# EAGLE design Radio_bridge (EAGLE 9.6.2)

## Sheet 1 of 2
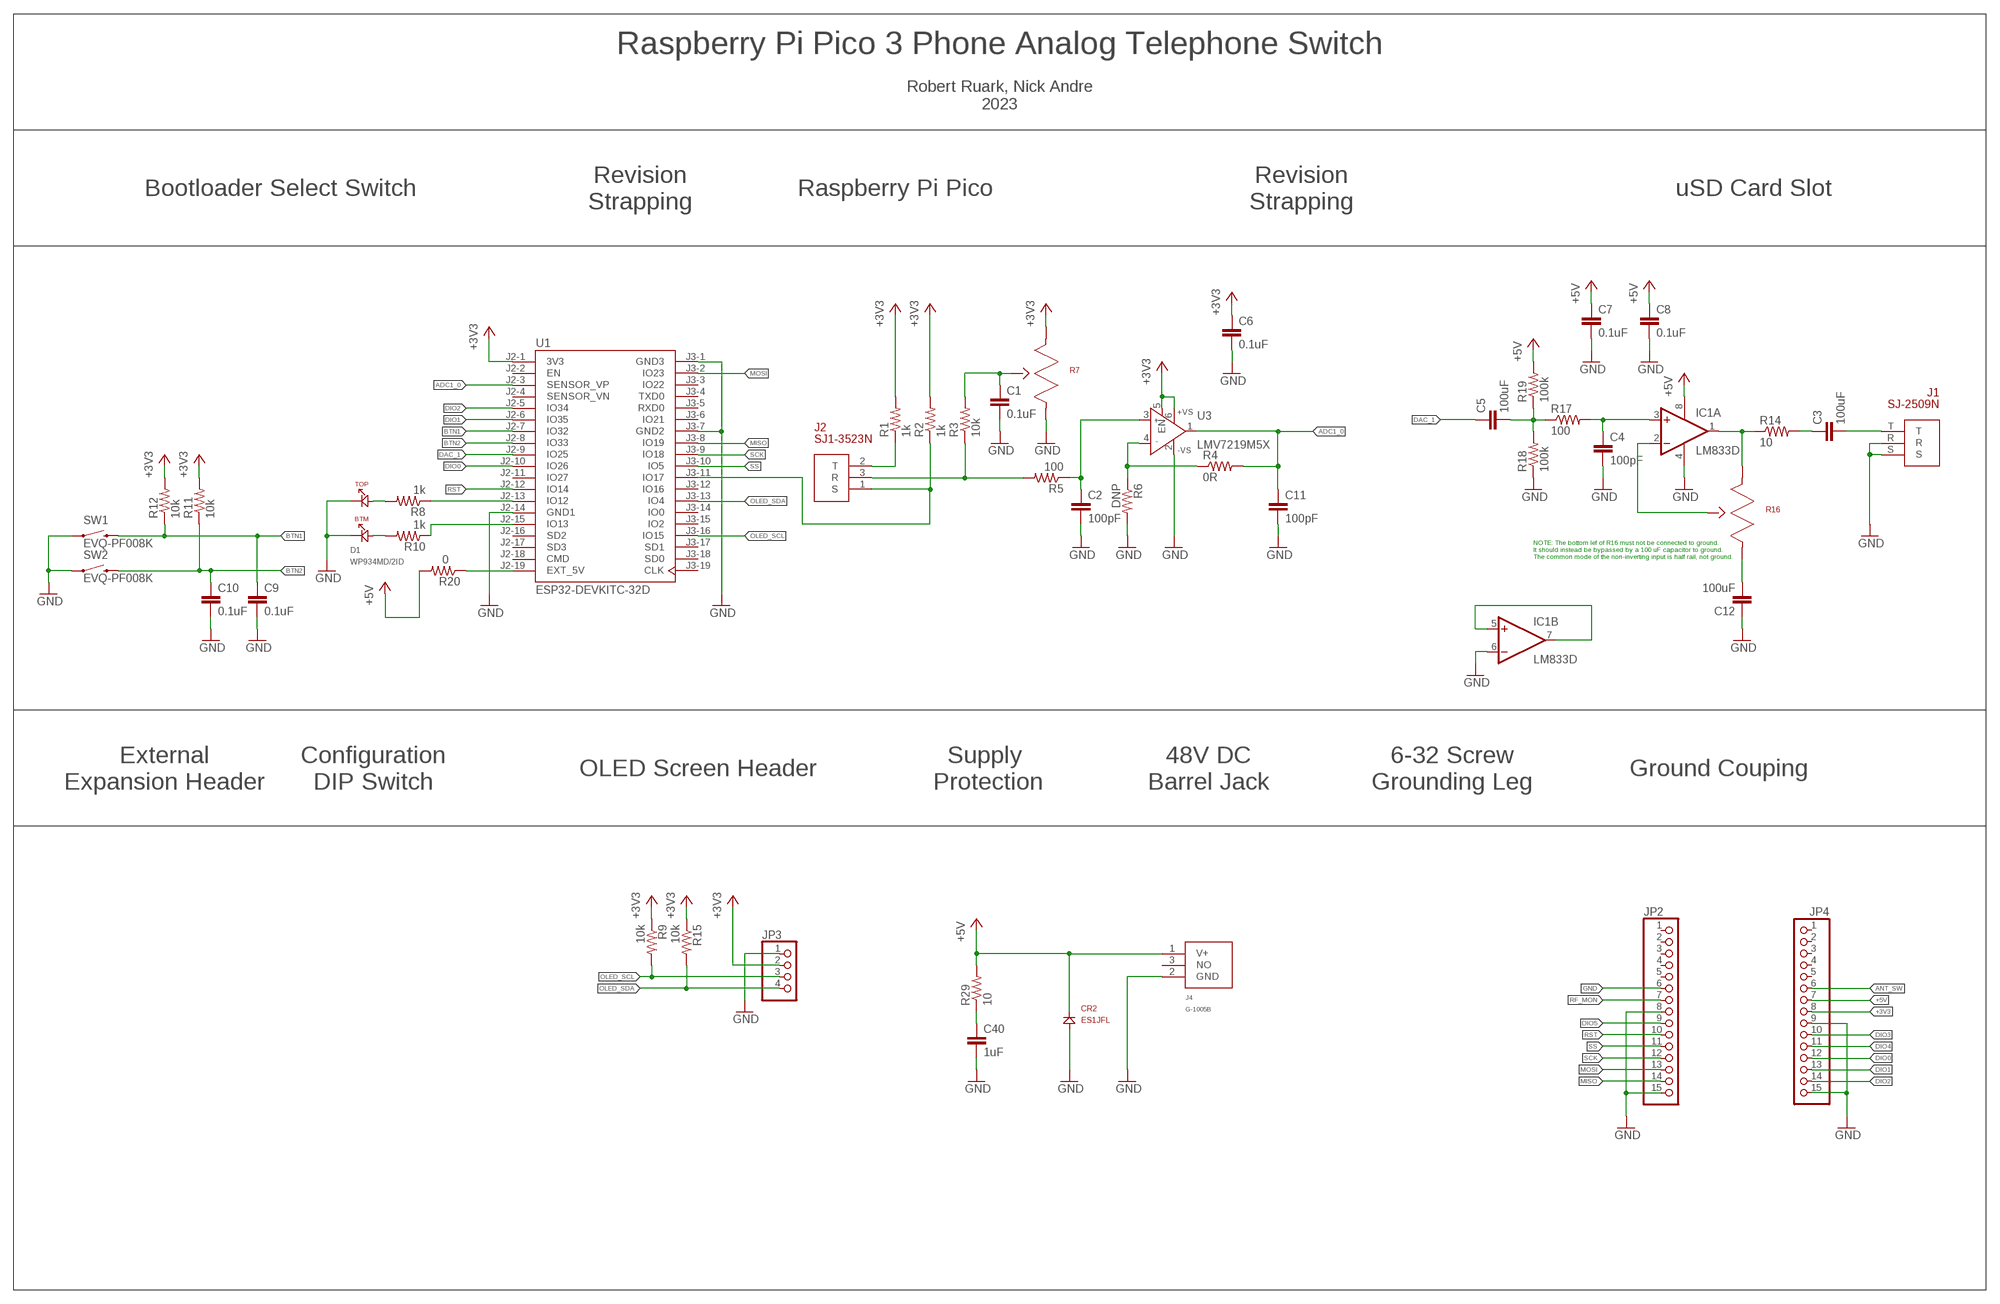
[diagram p0: schematic, sheet 1]

### Parts
C1  0.1uF  0603_CAPACITOR  [0603]
C2  100pF  0603_CAPACITOR  [0603]
C3  100uF  1210_CAPACITOR  [1210]
C4  100pF  0603_CAPACITOR  [0603]
C5  100uF  1210_CAPACITOR  [1210]
C6  0.1uF  0603_CAPACITOR  [0603]
C7  0.1uF  0603_CAPACITOR  [0603]
C8  0.1uF  0603_CAPACITOR  [0603]
C9  0.1uF  0603_CAPACITOR  [0603]
C10  0.1uF  0603_CAPACITOR  [0603]
C11  100pF  0603_CAPACITOR  [0603]
C12  100uF  1210_CAPACITOR  [1210]
C40  1uF  1206_CAPACITOR  [1206]
CR2  ES1JFL  [SOD123(AK)]
D1  WP934MD/2ID  [WP934MD/2ID]
IC1  LM833D  [SO08]
J1  SJ-2509N  [2.5MM_TRS]
J2  SJ1-3523N  [SJ1-3523N]
J4  G-1005B  [G-1005B]
JP2  PINHD-1X15  [1X15]
JP3  PINHD-1X4  [1X04]
JP4  PINHD-1X15  [1X15]
R1  1k  0603_RESISTOR  [0603]
R2  1k  0603_RESISTOR  [0603]
R3  10k  0603_RESISTOR  [0603]
R4  0R  0603_RESISTOR  [0603]
R5  100  0603_RESISTOR  [0603]
R6  DNP  0603_RESISTOR  [0603]
R7  10k  PTV09A-4025F-A103  [PTV09]
R8  1k  0603_RESISTOR  [0603]
R9  10k  0603_RESISTOR  [0603]
R10  1k  0603_RESISTOR  [0603]
R11  10k  0603_RESISTOR  [0603]
R12  10k  0603_RESISTOR  [0603]
R14  10  0603_RESISTOR  [0603]
R15  10k  0603_RESISTOR  [0603]
R16  10k  PTV09A-4025F-A103  [PTV09]
R17  100  0603_RESISTOR  [0603]
R18  100k  0603_RESISTOR  [0603]
R19  100k  0603_RESISTOR  [0603]
R20  0  0603_RESISTOR  [0603]
R29  10  1206_RESISTOR  [1206]
SW1  EVQ-PF008K  [EVQ-PF008K]
SW2  EVQ-PF008K  [EVQ-PF008K]
U1  ESP32-DEVKITC-32D  [MODULE_ESP32-DEVKITC-32D]
U3  LMV7219M5X  [SOT23-6]

### Nets
+3V3: C6.1 JP3.2 JP4.8 R1.2 R2.2 R7.1 R9.1 R11.2 R12.2 R15.1 U1.J2-1(3V3) U3.5(EN) U3.6(+VS)
+5V: C7.1 C8.1 CR2.K IC1.8(P:V+) J4.1(V+) JP4.7 R19.2 R20.2 R29.2
ADC1_0: C11.1 R4.2 U1.J2-3(SENSOR_VP) U3.1(OUT)
ANT_SW: JP4.6
BTN1: C9.1 R12.1 SW1.S2 U1.J2-7(IO32)
BTN2: C10.1 R11.1 SW2.S2 U1.J2-8(IO33)
DAC_1: C5.1 U1.J2-9(IO25)
DIO0: JP4.12 U1.J2-10(IO26)
DIO1: JP4.13 U1.J2-6(IO35)
DIO2: JP4.14 U1.J2-5(IO34)
DIO3: JP4.10
DIO4: JP4.11
DIO5: JP2.9
GND: C1.2 C2.2 C4.2 C6.2 C7.2 C8.2 C9.2 C10.2 C11.2 C12.1 C40.2 CR2.A D1.K1 D1.K2 IC1.4(P:V-) IC1.6(B:-IN) J1.R J1.S J4.2(GND) JP2.6 JP2.8 JP2.15 JP3.1 JP4.9 JP4.15 R6.2 R7.3 R18.1 SW1.S1 SW2.S1 U1.J2-14(GND1) U1.J3-1(GND3) U1.J3-7(GND2) U3.2(-VS)
MIC: C2.1 R5.1 U3.3(IN+)
MISO: JP2.14 U1.J3-8(IO19)
MOSI: JP2.13 U1.J3-2(IO23)
N$1: J2.2(T) R1.1
N$2: C1.1 R3.2 R7.2
N$3: R4.1 R6.1 U3.4(IN-)
N$4: J2.1(S) R2.1 U1.J3-11(IO17)
N$5: C3.2 J1.T
N$6: J2.3(R) R3.1 R5.2
N$7: D1.A2 R8.2
N$8: D1.A1 R10.2
N$9: R8.1 U1.J2-13(IO12)
N$10: R10.1 U1.J2-15(IO13)
N$11: C12.2 R16.3
N$12: IC1.5(B:+IN) IC1.7(B:OUT)
N$13: IC1.1(A:OUT) R14.1 R16.1
N$14: C3.1 R14.2
N$16: IC1.2(A:-IN) R16.2
N$17: C4.1 IC1.3(A:+IN) R17.2
N$18: C5.2 R17.1 R18.2 R19.1
N$20: R20.1 U1.J2-19(EXT_5V)
N$27: C40.1 R29.1
OLED_SCL: JP3.3 R9.2 U1.J3-16(IO15)
OLED_SDA: JP3.4 R15.2 U1.J3-13(IO4)
RF_MON: JP2.7
RST: JP2.10 U1.J2-12(IO14)
SCK: JP2.12 U1.J3-9(IO18)
SS: JP2.11 U1.J3-10(IO5)
Unconnected: J4.3(NO) JP2.1 JP2.2 JP2.3 JP2.4 JP2.5 JP4.1 JP4.2 JP4.3 JP4.4 JP4.5 U1.J2-2(EN) U1.J2-4(SENSOR_VN) U1.J2-11(IO27) U1.J2-16(SD2) U1.J2-17(SD3) U1.J2-18(CMD) U1.J3-3(IO22) U1.J3-4(TXD0) U1.J3-5(RXD0) U1.J3-6(IO21) U1.J3-12(IO16) U1.J3-14(IO0) U1.J3-15(IO2) U1.J3-17(SD1) U1.J3-18(SD0) U1.J3-19(CLK)

### Notes on the sheet
- Raspberry Pi Pico 3 Phone Analog Telephone Switch
- Robert Ruark, Nick Andre
  2023
- Bootloader Select Switch
- Revision
  Strapping
- Raspberry Pi Pico
- Revision
  Strapping
- uSD Card Slot
- NOTE: The bottom lef of R16 must not be connected to ground.
  It should instead be bypassed by a 100 uF capacitor to ground.
  The common mode of the non-inverting input is half rail, not ground.
- External
  Expansion Header
- Configuration
  DIP Switch
- OLED Screen Header
- Supply 
  Protection
- 48V DC
  Barrel Jack
- 6-32 Screw
  Grounding Leg
- Ground Couping

## Sheet 2 of 2
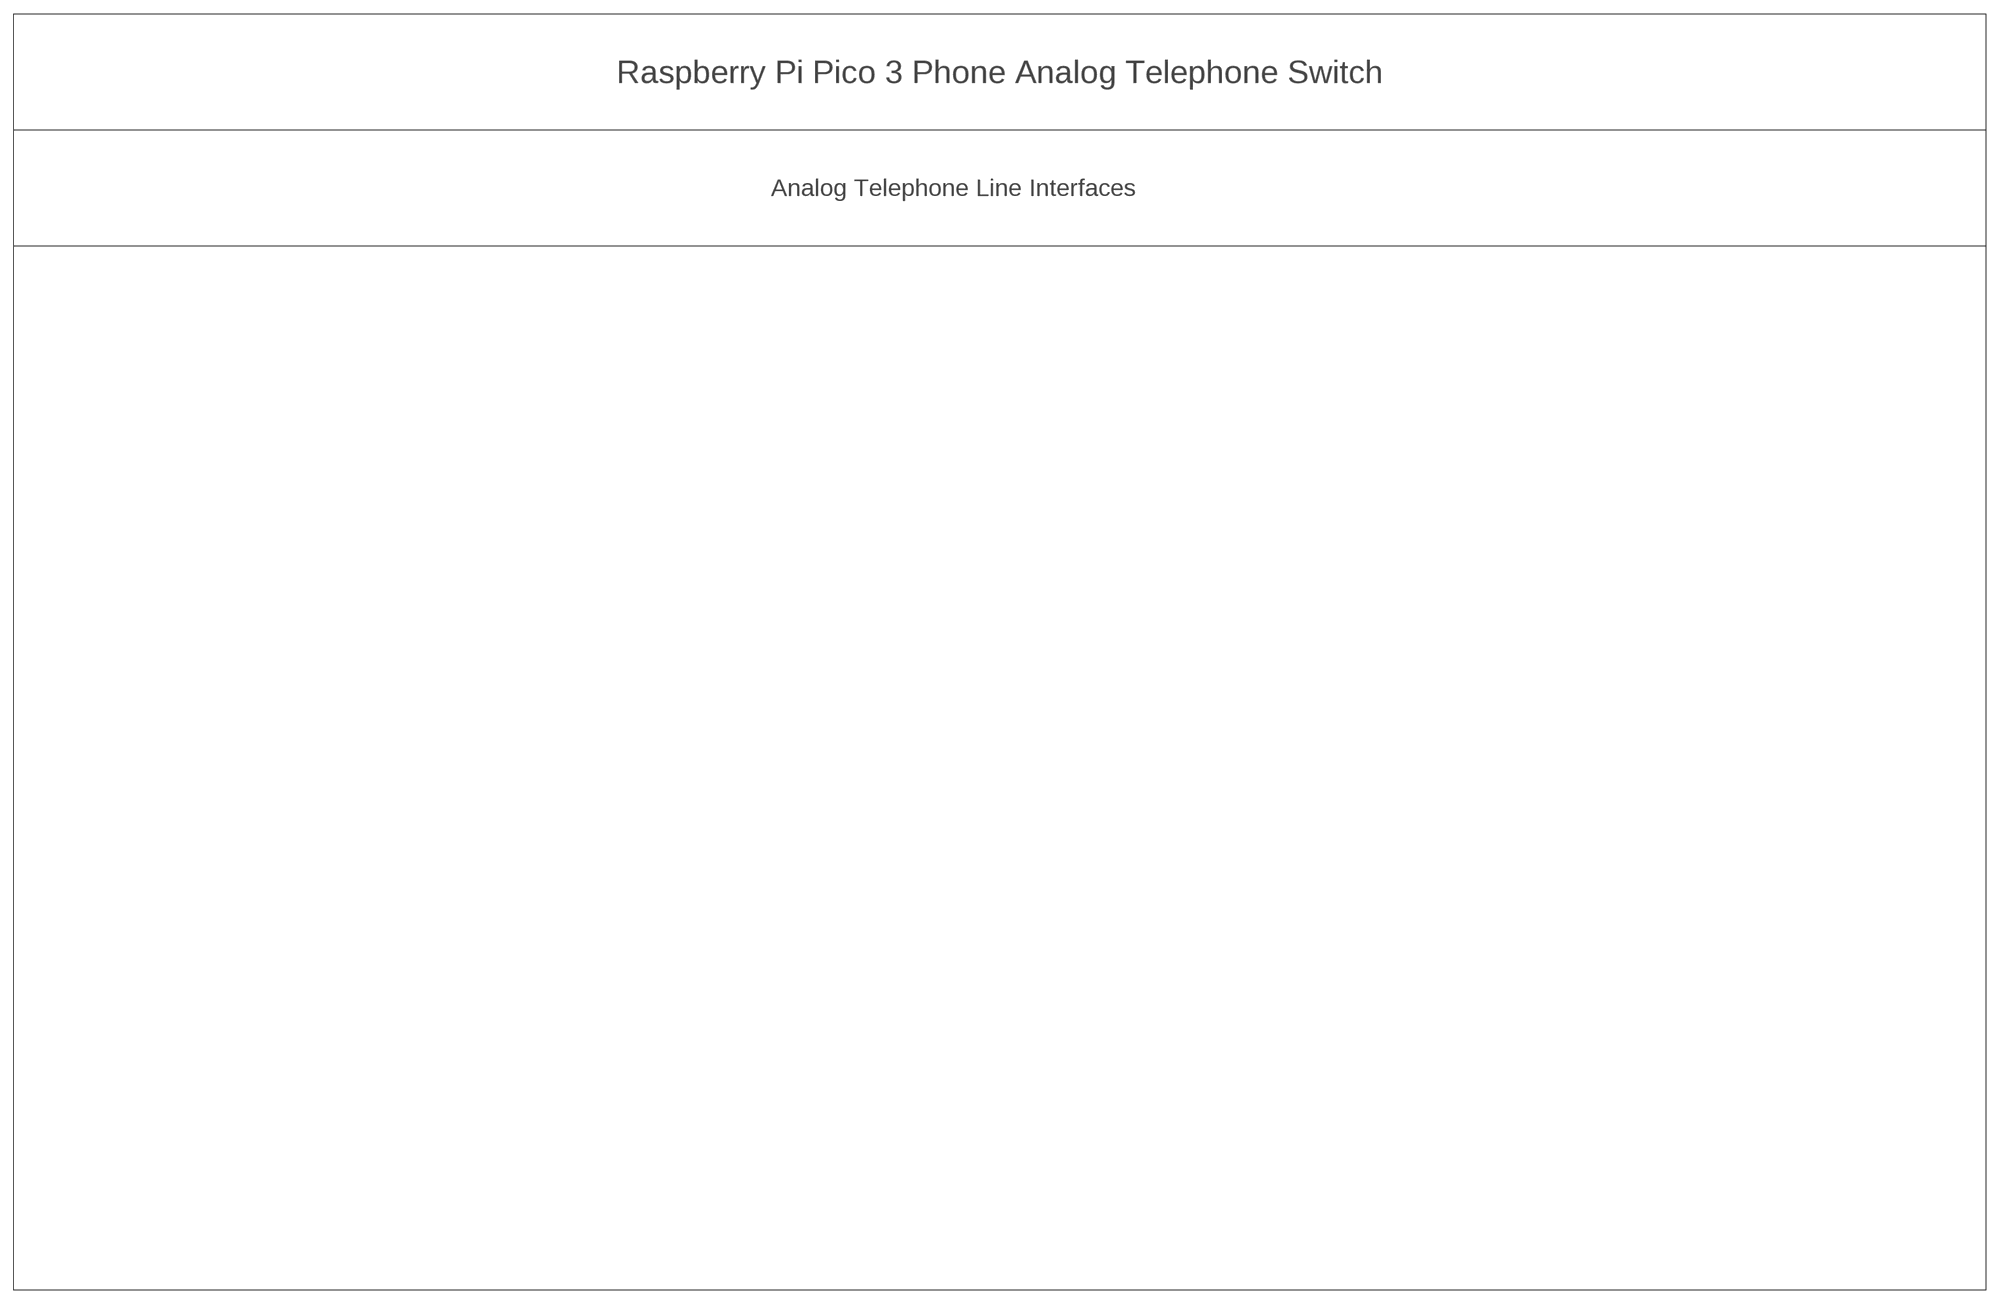
[diagram p1: schematic, sheet 2]

### Notes on the sheet
- Raspberry Pi Pico 3 Phone Analog Telephone Switch
- Analog Telephone Line Interfaces

## Library data of the parts
C1 C2 C4 C6-C11 = ruark2:0603_CAPACITOR: 0603 Capacitor -- WARNING: NO DEFINED VALUE OR PART NUMBER; VALUE: sel
C3 C5 C12 = ruark2:1210_CAPACITOR: NO VALUE
C40 = ruark2:1206_CAPACITOR: NO DEFINED PN; VALUE: sel
CR2 = ruark2:ES1JFL: Diode Standard 600 V 1A Surface Mount SOD-123F; PARTNO: ES1JFLCT-ND
D1 = ruark2:WP934MD/2ID: LED Circuit Board Indicator LED Circuit Board Indicator 2 High Red (x 2) Diffused, Tinted 2V 30mA Round with Domed Top 3mm, T-1 Through Hole, Right Angle. Compatible with SSF-LXH240IID
IC1 = linear:LM833: OP AMP
J1 = ruark2:SJ-2509N: 2.50mm (0.094", 3/32", Sub Mini, Miniature) - Headphone Phone Jack Stereo Connector Solder; PARTNO: CP-S2509N-ND
J2 = ruark2:SJ1-3523N: 3.50mm (0.141", 1/8", Mini Plug) - Headphone Phone Jack Stereo (3 Conductor, TRS) Connector Solder; PARTNO: CP1-3523N-ND
J4 = ruark2:G-1005B: Power Barrel Connector Jack 2.50mm ID (0.098"), 5.50mm OD (0.217") Through Hole, Right Angle; PARTNO: 1939-G-1005B-ND
JP2 JP4 = pinhead:PINHD-1X15: PIN HEADER
JP3 = pinhead:PINHD-1X4: PIN HEADER
R1-R6 R8-R12 R14 R15 R17-R20 = ruark2:0603_RESISTOR: 0603 Resistor -- WARNING: NO DEFINED PART NUMBER OR VALUE; VALUE: sel
R7 R16 = ruark2:PTV09A-4025F-A103: 10k Ohm 1 Gang Logarithmic Through Hole, Snap In Potentiometer None 1 Turn Carbon 0.05W, 1/20W PC Pins, Board Locks; PARTNO: PTV09A-4025F-A103-ND
R29 = ruark2:1206_RESISTOR: NO DEFINED PN; VALUE: sel
SW1 SW2 = ruark2:EVQ-PF008K: Tactile Switch SPST-NO Side Actuated Through Hole, Right Angle; PARTNO: P10880S-ND
U1 = ESP32-DEVKITC-32D:ESP32-DEVKITC-32D: Check availability <https://pricing.snapeda.com/parts/ESP32-DEVKITC-32D/Espressif%20Systems/view-part?ref=eda>; AVAILABILITY: In Stock; DESCRIPTION: WiFi Development Tools (802.11) ESP32 General Development Kit, ESP32-WROOM-32D on the board; MF: Espressif Systems; MP: ESP32-DEVKITC-32D; PACKAGE: None; PRICE: None; PURCHASE-URL: https://pricing.snapeda.com/search/part/ESP32-DEVKITC-32D/?ref=eda
U3 = ruark2:LMV7219M5X: Comparator General Purpose Push-Pull, Rail-to-Rail SOT-23-5 (OPA320 pinout compatible); PARTNO: LMV7219M5X-ND

## Net classes
1 HV: clearance 0.406 mm

## Board
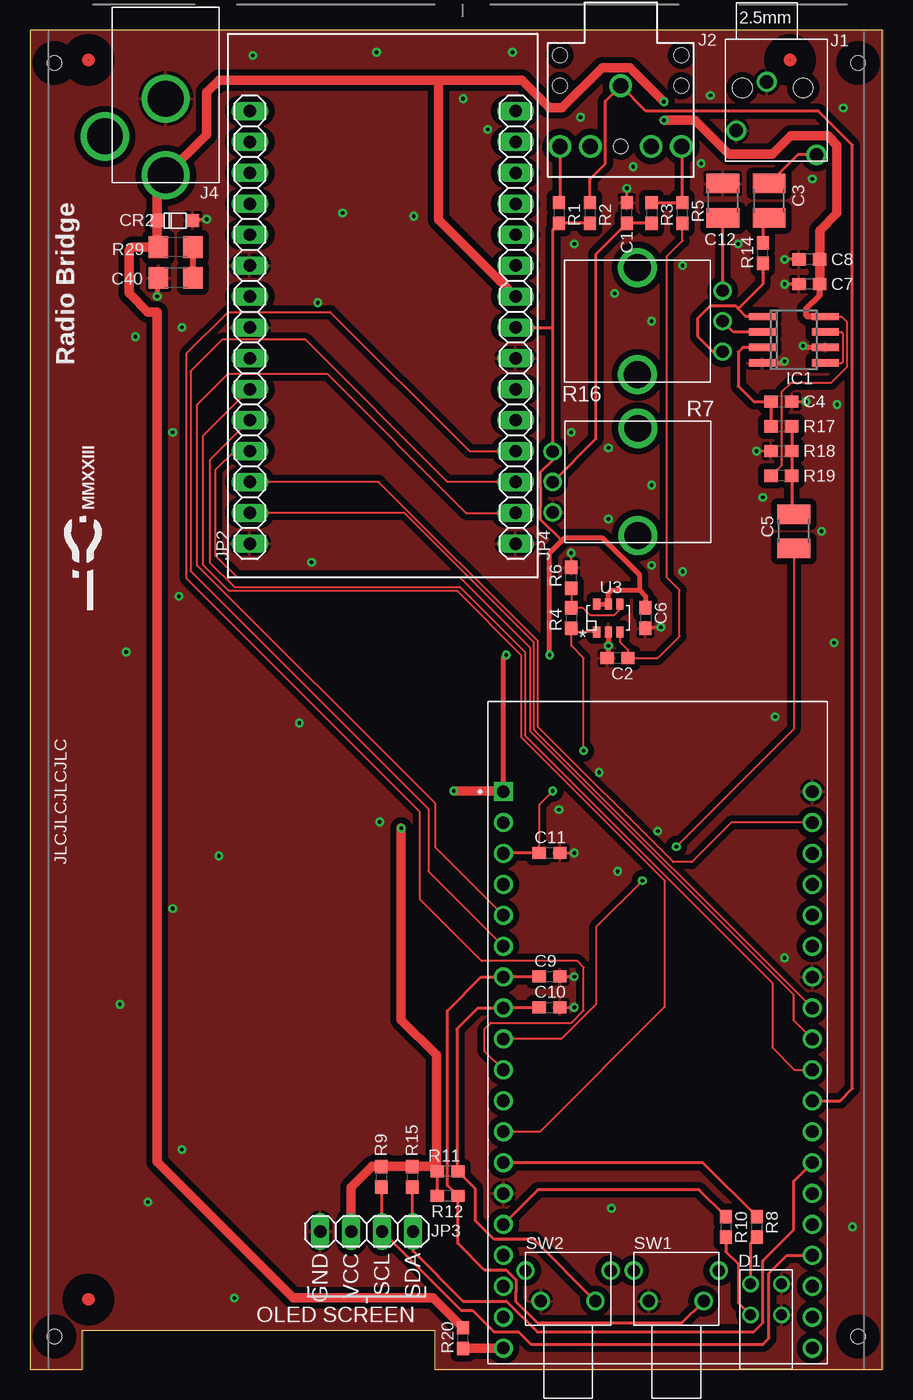
[diagram p2: board, top side]
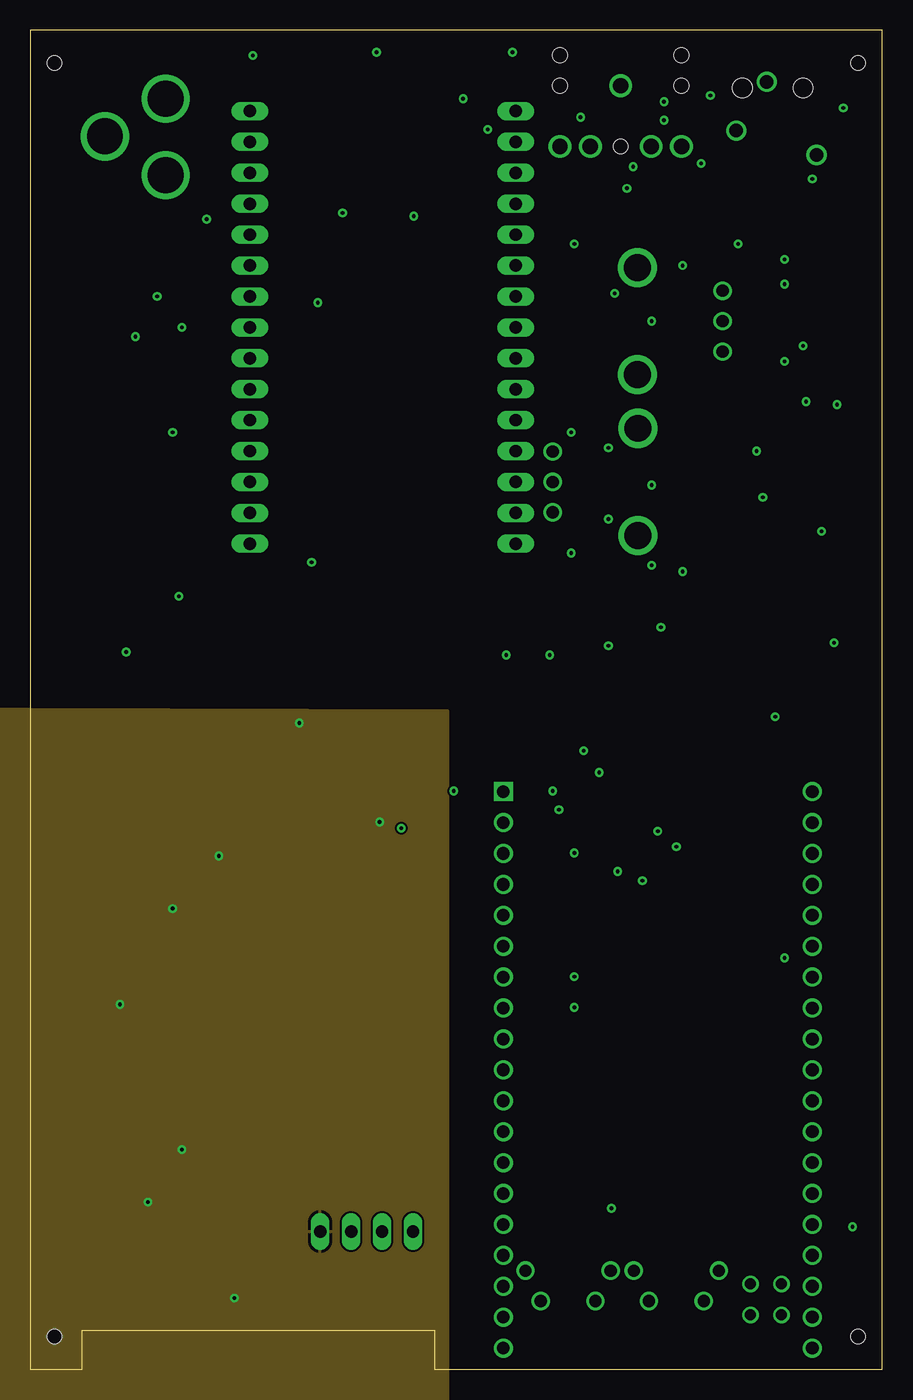
[diagram p3: board, inner layer Route2]
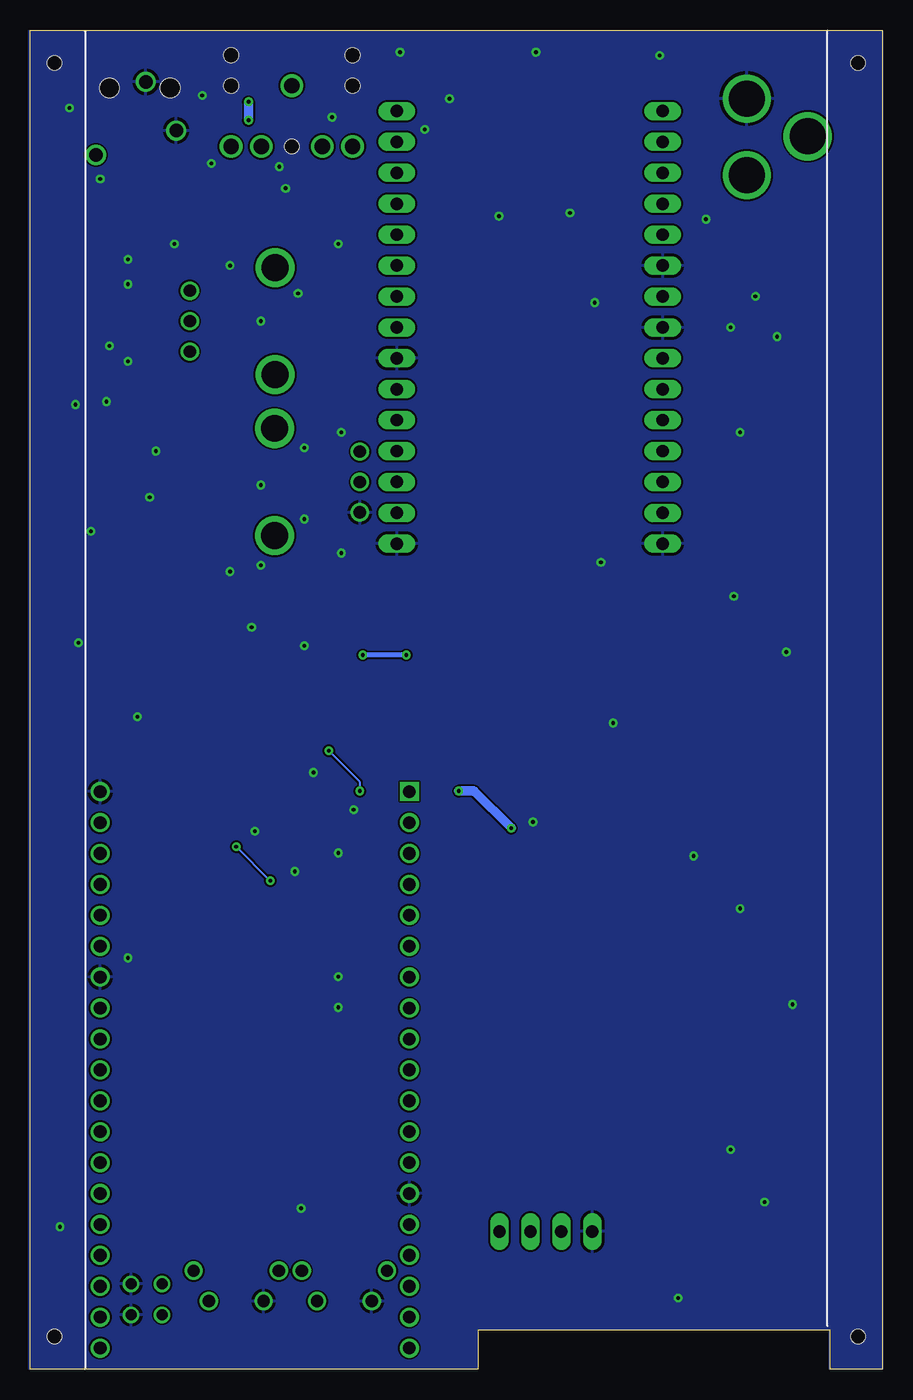
[diagram p4: board, bottom side, seen from below]

Size 70 x 110 mm. Coordinates in mm from the lower left corner, seen from the top.
Outline: 0,0 4.27,0 4.27,3.18 33.22,3.18 33.22,0 70,0 70,110 0,110 0,0
Copper layers (1*16): Top 0.035mm / dielectric 1.5mm / Bottom 0.035mm
Design rules "default *": minimum track width 6mil, minimum drill 12mil, track to track 6mil, track to pad 6mil, pad to pad 6mil, via to via 6mil, smd to smd 6mil, copper to edge 0mil, drill to drill 6mil, minimum pad ring 0.13mm, minimum via ring 8mil, stop-mask expansion 4mil, vias tented up to drill 12mil, thermal gap 10mil
Holes 1.15 mm at 1.98,107.32 68.02,107.32 1.98,2.68 68.02,2.68
tRestrict: area 3.7,106.5 to 5.9,108.7; area 61.3,106.5 to 63.5,108.7; area 3.7,4.6 to 5.9,6.8; area 1,106.3 to 3,108.3; area 67,106.3 to 69,108.3; area 67,1.7 to 69,3.7; area 1,1.7 to 3,3.7
bRestrict: area 32,-53.3 to 34,-51.3; area -34,-53.3 to -32,-51.3

### Footprints (pad centres in the part's own frame; a part is rotated, then mirrored left to right if it is on the bottom)
0603 = smd 1.1 x 1: 1 -0.85,0; 2 0.85,0
1210 = smd 1.6 x 2.7: 1 -1.4,0; 2 1.4,0
1206 = smd 1.6 x 1.8: 1 -1.4,0; 2 1.4,0
SOD123(AK) = smd 1.1 x 1.1: A 1.45,0; K -1.45,0
WP934MD/2ID = drill 0.9: A1 -1.27,4.45; A2 -1.27,6.99; K1 1.27,4.45; K2 1.27,6.99
SO08 = smd 0.6 x 2.2: 1 -1.905,-2.6; 2 -0.635,-2.6; 3 0.635,-2.6; 4 1.905,-2.6; 5 1.905,2.6; 6 0.635,2.6; 7 -0.635,2.6; 8 -1.905,2.6
2.5MM_TRS = drill 1.1: R 2.5,7.5; S 0,3.5; T -4.1,9.5 | hole 1.6: -3,4; 2,4
SJ1-3523N = drill 1.25: 1 0,-3.5; 2 -5,-8.5; 3 5,-8.5; 10 -2.5,-8.5; 11 2.5,-8.5 | hole 1.2: 0,-8.5; 5,-1; -5,-1; 5,-3.5; -5,-3.5
G-1005B = drill 2.95: 1 0,13.8; 2 0,7.5; 3 5,10.6
1X15 = drill 1.016 long: 1 -17.78,0; 2 -15.24,0; 3 -12.7,0; 4 -10.16,0; 5 -7.62,0; 6 -5.08,0; 7 -2.54,0; 8 0,0; 9 2.54,0; 10 5.08,0; 11 7.62,0; 12 10.16,0; 13 12.7,0; 14 15.24,0; 15 17.78,0
1X04 = drill 1.016 long: 1 -3.81,0; 2 -1.27,0; 3 1.27,0; 4 3.81,0
PTV09 = drill 1: 1 -2.5,0; 2 0,0; 3 2.5,0 | drill 2.2: NC1 -4.4,7; NC2 4.4,7
EVQ-PF008K = drill 1: NC1 -3.5,2.5; NC2 3.5,2.5; S1 -2.25,0; S2 2.25,0
MODULE_ESP32-DEVKITC-32D = drill 1.04 square: J2-1 -12.7,19.76 | drill 1.04: J2-2 -12.7,17.22; J2-3 -12.7,14.68; J2-4 -12.7,12.14; J2-5 -12.7,9.6; J2-6 -12.7,7.06; J2-7 -12.7,4.52; J2-8 -12.7,1.98; J2-9 -12.7,-0.56; J2-10 -12.7,-3.1; J2-11 -12.7,-5.64; J2-12 -12.7,-8.18; J2-13 -12.7,-10.72; J2-14 -12.7,-13.26; J2-15 -12.7,-15.8; J2-16 -12.7,-18.34; J2-17 -12.7,-20.88; J2-18 -12.7,-23.42; J2-19 -12.7,-25.96; J3-1 12.7,19.76; J3-2 12.7,17.22; J3-3 12.7,14.68; J3-4 12.7,12.14; J3-5 12.7,9.6; J3-6 12.7,7.06; J3-7 12.7,4.52; J3-8 12.7,1.98; J3-9 12.7,-0.56; J3-10 12.7,-3.1; J3-11 12.7,-5.64; J3-12 12.7,-8.18; J3-13 12.7,-10.72; J3-14 12.7,-13.26; J3-15 12.7,-15.8; J3-16 12.7,-18.34; J3-17 12.7,-20.88; J3-18 12.7,-23.42; J3-19 12.7,-25.96
SOT23-6 = smd 0.6 x 0.9: 1 -0.95,-1.15; 2 0,-1.15; 3 0.95,-1.15; 4 0.95,1.15; 5 0,1.15; 6 -0.95,1.15

### Placement (x,y rotation side)
C1  49.02,95 90 top
C2  48.26,58.42 180 top
C3  60.71,96.01 90 top
C4  61.72,79.5 0 top
C5  62.74,68.83 90 top
C6  50.55,61.72 270 top
C7  64.01,89.15 180 top
C8  64.01,91.19 180 top
C9  42.67,32.26 0 top
C10  42.67,29.72 0 top
C11  42.67,42.42 0 top
C12  56.9,96.01 270 top
C40  11.94,89.66 180 top
CR2  11.89,94.37 0 top
D1  60.45,0 0 top
IC1  62.74,84.58 270 top
J1  60.51,109.27 180 top
J2  48.51,108.97 0 top
J4  11.12,111.9 180 top
JP2  18.03,85.6 270 top
JP3  27.63,11.31 0 top
JP4  39.88,85.6 270 top
R1  43.43,95 270 top
R2  45.97,95 270 top
R3  51.05,95 270 top
R4  44.45,61.72 270 top
R5  53.59,95 90 top
R6  44.45,65.02 90 top
R7  42.93,72.9 270 top
R8  59.69,11.68 270 top
R9  28.84,15.8 270 top
R10  57.15,11.68 270 top
R11  34.29,16.26 180 top
R12  34.29,14.22 180 top
R14  60.2,91.69 90 top
R15  31.38,15.8 270 top
R16  56.9,86.11 90 top
R17  61.72,77.47 180 top
R18  61.72,75.44 0 top
R19  61.72,73.41 180 top
R20  35.56,2.54 90 top
R29  11.94,92.2 180 top
SW1  53.09,5.59 0 top
SW2  44.2,5.59 0 top
U1  51.56,27.69 0 top
U3  47.5,61.72 0 top

### Tracks (layer width: path | path; a pad name or v marks a point on that pad's centre or on a via)
+3V3  (via drill 0.3)
  Top 0.254: R12.2 R11.2 33.36,16.34 33.05,16.65 | 42.93,85.6 R7.1 42.93,74.68 41.9,73.65 41.9,72.47 41.91,72.46 41.91,70.84 41.9,70.82 41.9,69.86 43.69,68.07 | 42.93,85.6 42.93,93.64 R1.2 | R2.2 R1.2 | 43.09,94.49 R1.2 | JP4.8 42.93,85.6
  Top 0.406: U1.J2-1 38.86,58.42 v39.12,58.67 | U3.6 U3.5 47.5,63.75 47.75,64.01 50.04,64.01 | 50.04,64.01 50.55,63.5 C6.1 | v42.67,58.67 42.67,67.06 43.69,68.07 43.94,68.33 46.99,68.33 50.04,65.28 50.04,64.01
  Top 0.762: v34.8,47.5 38.81,47.5 U1.J2-1 | v30.48,44.45 30.48,28.7 33.36,25.82 33.36,16.76 | 33.36,16.76 33.36,16.34 | JP3.2 26.36,14.93 28.08,16.65 R9.1 R15.1 33.24,16.65 33.36,16.76
  Bottom 0.406: v39.12,58.67 v42.67,58.67
  Bottom 0.762: v34.8,47.5 33.53,47.5 v30.48,44.45
+5V  (via drill 0.3)
  Top 0.152: IC1.8 66.67,86.49 67.11,86.06 67.11,82.35 65.79,81.03 62.48,81.03 61.72,80.26 61.72,74.26 R19.2
  Top 0.508: IC1.8 63.88,86.49 63.75,86.61 63.75,87.12 64.86,88.23 C7.1
  Top 0.762: v52.07,104.14 49.27,106.94 46.99,106.94 43.69,103.63 42.67,103.63 40.39,105.92 33.53,105.92 | v52.07,102.62 54.61,102.62 57.4,99.82 60.96,99.82 62.48,101.35 65.53,101.35 66.29,100.58 66.29,95 64.86,93.56 C8.1 C7.1 | R20.2 33.11,5.84 21.59,5.84 10.41,17.02 10.41,86.87 9.65,86.87 8.13,88.39 8.13,91.95 8.38,92.2 R29.2 10.44,92.3 CR2.K 10.44,97.41 J4.1 14.48,101.45 14.48,104.9 15.49,105.92 33.53,105.92 | JP4.7 38.63,89.38 38.58,89.38 33.53,94.43 33.53,105.92
  Bottom 0.762: v52.07,104.14 v52.07,102.62
ADC1_0  (via drill 0.3)
  Top 0.152: U3.1 44.75,60.57 44.53,60.79 | 44.53,60.79 R4.2 | C11.1 41.82,46.39 v42.93,47.5 | v45.47,50.8 45.47,58.42 44.45,59.44 44.45,60.71 44.53,60.79
  Top 0.254: C11.1 38.91,42.42 U1.J2-3
  Bottom 0.152: v42.93,47.5 42.93,48.26 v45.47,50.8
BTN1
  Top 0.254: 54.86,6.06 SW1.S2 53.56,3.81 41.66,3.81 39.88,5.59 39.88,6.32 39.92,6.37 39.92,7.32 39.12,8.13 37.34,8.13 35.14,10.33 R12.1 34.27,15.1 34.27,29.44 37.03,32.21 U1.J2-7 41.77,32.21 C9.1
BTN2
  Top 0.254: C10.1 41.77,29.67 U1.J2-8 36.78,29.67 35.05,27.94 35.05,16.34 R11.1 36.58,14.82 36.58,12.19 38.1,10.67 41.37,10.67 SW2.S2
DAC_1  (via drill 0.3)
  Top 0.152: C5.1 62.74,52.58 v53.09,42.93 | v50.29,40.13 46.48,36.32 46.48,29.97 43.64,27.13 U1.J2-9
  Bottom 0.152: v53.09,42.93 v50.29,40.13
DIO0
  Top 0.152: JP4.12 36.07,75.44 24.64,86.87 16.26,86.87 12.85,83.46 12.85,64.95 32,45.8 32,38.61 37.08,33.53 44.96,33.53 45.47,33.02 45.47,29.46 44.45,28.45 37.85,28.45 37.34,27.94 37.34,26.11 U1.J2-10
DIO1
  Top 0.152: JP4.13 34.29,72.9 22.61,84.58 15.75,84.58 13.16,81.99 13.16,65.58 32.72,46.02 32.72,40.89 U1.J2-6
DIO2
  Top 0.152: JP4.14 35.81,70.36 24.38,81.79 16.26,81.79 13.72,79.25 13.72,66.04 33.27,46.48 33.27,42.87 U1.J2-5
GND  (via drill 0.3)
  Top 0.152: R6.2 v44.45,67.06 | R18.1 v59.69,75.44
  Top 0.254: C9.2 v44.7,32.26 | C10.2 v44.7,29.72 | C11.2 v44.7,42.42 | C1.2 v49.02,97.03 | C8.2 v61.98,91.19 | C7.2 v61.98,89.15 | C4.2 v63.75,79.5 | CR2.A 13.45,94.49 v14.48,94.49 | C6.2 50.63,60.96 v51.82,60.96
  Top 0.406: U3.2 v47.5,59.44 47.5,58.51 C2.2 | IC1.4 61.85,82.68 v61.98,82.8 | IC1.6 63.63,83.95 v63.5,84.07 | C40.2 10.41,89.54 v10.41,88.14
  other vias: 66.29,79.25 60.2,71.63 51.05,72.64 47.5,75.69 47.5,69.85 51.05,66.04 53.59,65.53 65.02,68.83 61.21,53.59 51.56,44.2 48.26,40.89 46.74,49.02 43.43,45.97 28.7,44.96 23.11,66.29 15.49,42.16 11.68,37.85 12.45,18.03 9.65,13.72 16.76,5.84 7.37,29.97 7.87,58.93 11.68,76.96 12.45,85.6 8.64,84.84 23.62,87.63 31.5,94.74 25.65,95 47.75,13.21 61.98,33.78 67.56,11.68 66.04,59.69 18.29,107.95 39.62,108.2 28.45,108.2 37.59,101.85 35.56,104.39 49.53,98.81 44.45,76.96 44.7,92.46 48.01,88.39 51.05,86.11 53.59,90.68 55.12,99.06 64.26,97.79 58.17,92.46 66.8,103.63 55.88,104.65 45.21,102.87 12.19,63.5 22.1,53.09
  pour Route2: -34.29,54.36 34.29,54.1 34.29,-54.36 -34.29,-54.1
  pour Bottom: 0,0 4.32,0 4.32,3.3 33.27,3.3 33.27,0 70.1,0 70.1,109.98 0,109.98
  pour Top (isolate 0.508): 0,0 4.32,0 4.32,3.3 33.27,3.3 33.27,0 70.1,0 70.1,109.98 0,109.98
MIC
  Top 0.152: U3.3 48.45,59.76 49.11,59.09 C2.1 51.56,58.42 53.34,60.2 53.34,64.01 52.32,65.02 52.32,91.44 53.59,92.71 R5.1
MISO
  Top 0.152: U1.J3-8 41.4,52.53 41.4,59.69 30.73,70.36 JP2.14
MOSI
  Top 0.152: U1.J3-2 57.61,44.91 54.36,41.66 52.83,41.66 41.71,52.78 41.71,59.82 28.62,72.9 JP2.13
N$1
  Top 0.254: J2.2 43.51,95.93 R1.1
N$2
  Top 0.254: R3.2 C1.1 46.48,91.61 46.48,76.45 R7.2
N$3
  Top 0.152: U3.4 48.45,62.42 48.01,61.98 45.97,61.98 45.38,62.57 R4.1 R6.1
N$4
  Top 0.254: R2.1 45.97,97.79 47.24,99.06 47.24,104.2 J2.1 50.6,103.38 64.77,103.38 67.56,100.58 67.56,23.06 66.55,22.05 U1.J3-11
N$5
  Top 0.254: J1.T 63.06,99.77 C3.2
N$6
  Top 0.254: J2.3 53.59,100.39 R5.2 R3.1
N$7
  Top 0.254: R8.2 59.18,10.33 D1.A2
N$8
  Top 0.254: R10.2 57.15,9.65 58.17,8.64 58.17,5.47 D1.A1
N$9
  Top 0.254: R8.1 55.26,16.97 U1.J2-13
N$10
  Top 0.254: R10.1 54.95,14.73 41.71,14.73 U1.J2-15
N$11
  Top 0.254: R16.3 C12.2
N$12
  Top 0.152: IC1.7 66.67,85.22 66.8,85.09 66.8,82.8 66.67,82.68 IC1.5
N$13
  Top 0.254: R16.1 56.09,83.61 54.86,84.84 54.86,86.36 55.88,87.38 57.91,87.38 58.17,87.12 | IC1.1 58.8,86.49 58.17,87.12 | R14.1 60.2,89.15 58.17,87.12
N$14
  Top 0.254: C3.1 60.2,94.1 R14.2
N$16
  Top 0.254: IC1.2 57.78,85.22 R16.2
N$17
  Top 0.254: IC1.3 58.55,83.95 58.17,83.57 58.17,80.77 59.44,79.5 C4.1 R17.2
N$18
  Top 0.254: R17.1 R18.2 R19.1 62.57,70.4 C5.2
N$20
  Top 0.254: 38.83,1.69 U1.J2-19
  Top 0.762: R20.1 35.6,1.73 U1.J2-19
N$27
  Top 0.508: R29.1 C40.1
OLED_SCL
  Top 0.254: R9.2 28.84,11.38 JP3.3 35.39,4.83 36.32,4.83 38.1,3.05 40.13,3.05 41.15,2.03 60.2,2.03 60.71,2.54 60.71,7.87 62.18,9.35 U1.J3-16
OLED_SDA
  Top 0.254: R15.2 31.38,11.38 JP3.4 31.44,9.7 35.56,5.59 39.12,5.59 41.66,3.05 59.44,3.05 60.2,3.81 60.2,8.89 62.74,11.43 62.74,15.44 U1.J3-13
RST
  Top 0.152: JP2.10 14.17,76.66 14.17,66.09 16.31,63.96 35.05,63.96 40.34,58.67 40.34,51.94 52.11,40.17 52.11,29.76 41.86,19.51 U1.J2-12
  Bottom 0.254: 38.81,19.56 U1.J2-12
SCK
  Top 0.152: U1.J3-9 62.74,28.65 62.74,30.76 41.1,52.4 41.1,59.23 35.31,65.02 17.02,65.02 15.24,66.8 15.24,73.91 16.76,75.44 JP2.12
SS
  Top 0.152: JP2.11 14.73,74.68 14.73,66.29 16.76,64.26 35.31,64.26 40.64,58.93 40.64,52.07 60.96,31.75 60.96,26.42 62.79,24.59 U1.J3-10
(copper drawn outside any net)
  shapes: Top circle x3

### Text on the board
tPlace: Radio Bridge | MMXXIII | GND | VCC | SCL | SDA | OLED SCREEN
tNames: JLCJLCJLCJLC
tStop: 044